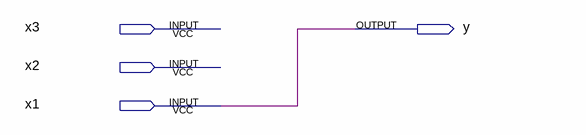
[diagram p0: schematic sheet]
// Quartus schematic LC1.bdf as structural Verilog: 0 symbols, 4 pins
module LC1 (
  input  x3,
  input  x2,
  input  x1,
  output y
);


  assign y = x1;
endmodule
